# Altium schematic sheet InvidualShelfSR.SchDoc
size A4
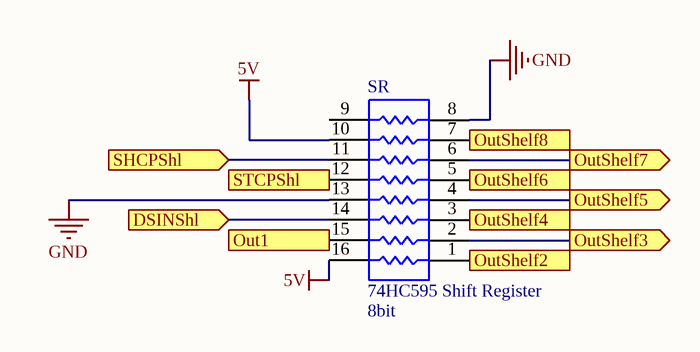
[diagram p0: InvidualShelfSR.SchDoc]

## Parts
SR  74HC595 Shift Register  value 8bit  [SO-16_L]

## Ports
DSINShl (in), Out1 (out), OutShelf2 (out), OutShelf3 (out), OutShelf4 (out), OutShelf5 (out), OutShelf6 (out), OutShelf7 (out), OutShelf8 (out), SHCPShl (in), STCPShl (in)

## Nets
5V: SR.10 SR.16
GND: SR.8 SR.13
DSINShl: SR.14 ; port DSINShl
Out1: SR.15 ; port Out1
OutShelf2: SR.1 ; port OutShelf2
OutShelf3: SR.2 ; port OutShelf3
OutShelf4: SR.3 ; port OutShelf4
OutShelf5: SR.4 ; port OutShelf5
OutShelf6: SR.5 ; port OutShelf6
OutShelf7: SR.6 ; port OutShelf7
OutShelf8: SR.7 ; port OutShelf8
SHCPShl: SR.11 ; port SHCPShl
STCPShl: SR.12 ; port STCPShl

Not connected (* = marked no-connect by the designer): SR 9

## Notes on the sheet
- Title
- Size:
- Date:
- A4
- Number:
- Time:
- Revision:
- Sheet
- of
- File:

## Library data of the parts
SR = Res Pack3: Isolated Resistor Network; Published: 24-Mar-1999; LatestRevisionDate: 29-May-2009; LatestRevisionNote: IPC-7351 Footprint Added.; PackageReference: SO-16; Publisher: Altium Limited; PackageDescription: 16-Pin Small Outline Integrated Circuit 1.27 mm Pitch; Code_JEDEC: MS-012-AC; Code_IPC: SOIC127P600-16